# Altium schematic sheet espDownloadBoard.SchDoc
size A4; SheetNumber: 1; SheetTotal: 1
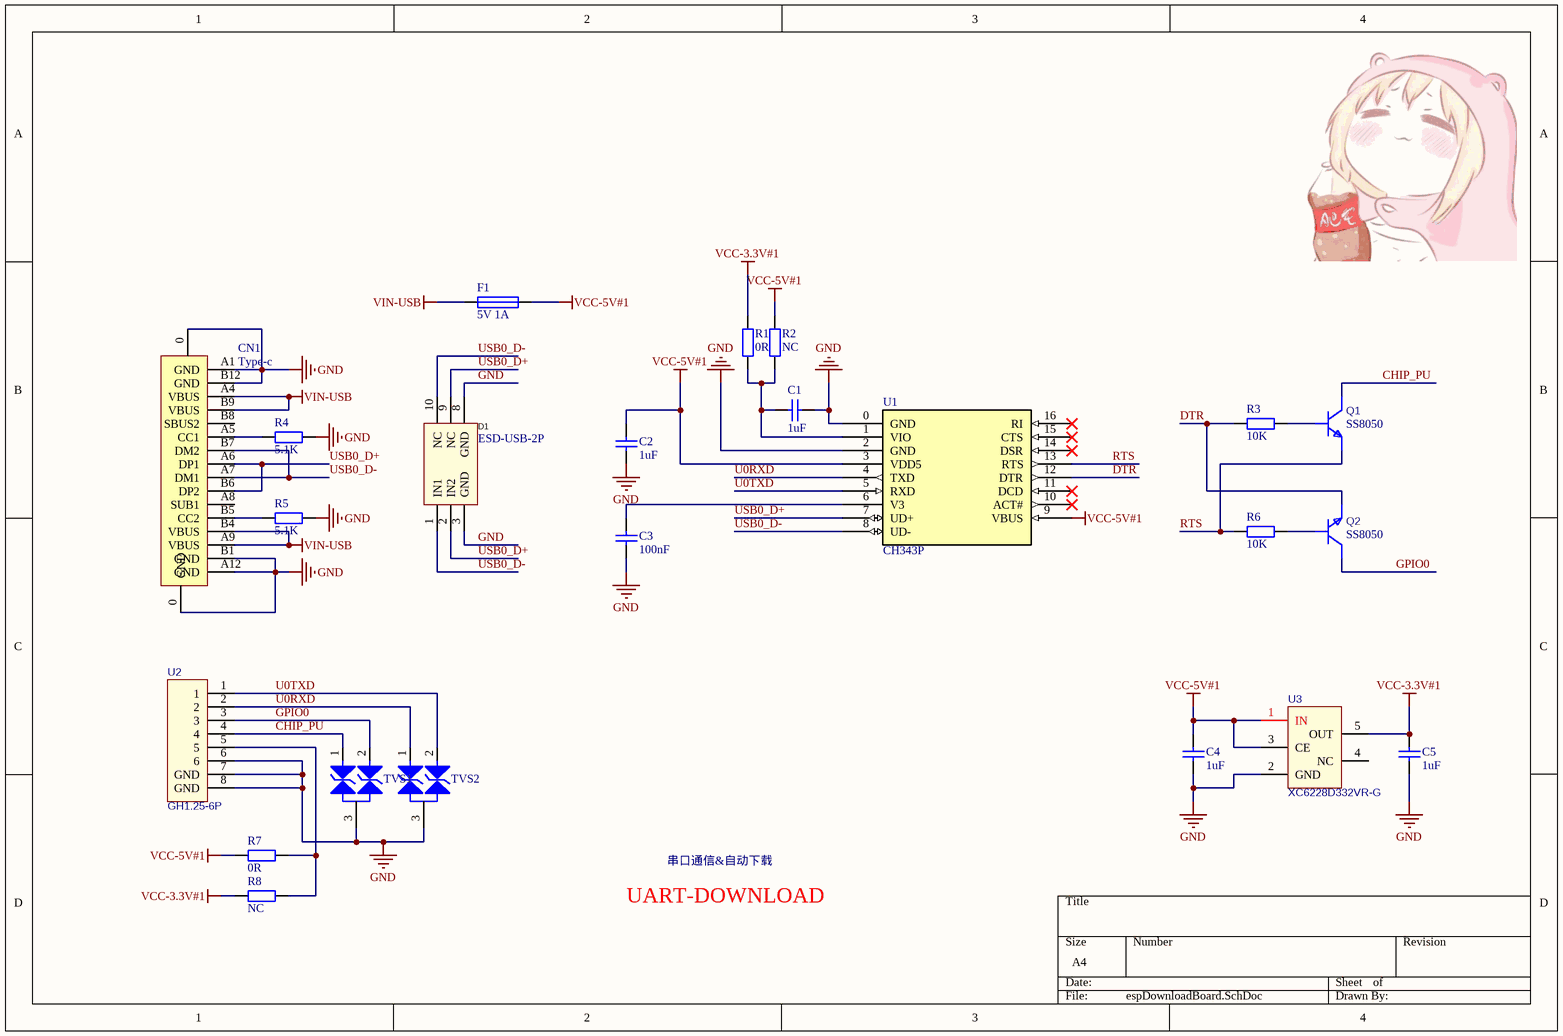
[diagram p0: espDownloadBoard.SchDoc]

## Parts
C1  1uF  [0603-C]
C2  1uF  [0603-C]
C3  100nF  [0603-C]
C4  1uF  [0603-C]
C5  1uF  [0603-C]
CN1  Type-c  [Type-c 16pin]
D1  ESD-USB-2P  [SLP2510P8-2P]
F1  5V 1A  [0805-R]
Q1  SS8050  [SOT23-3M]
Q2  SS8050  [SOT23-3M]
R1  0R  [0603-R]
R2  NC  [0603-R]
R3  10K  [0603-R]
R4  5.1K  [0603-R]
R5  5.1K  [0603-R]
R6  10K  [0603-R]
R7  0R  [0603-R]
R8  NC  [0603-R]
TVS1  ESDA5V3L  [ESDA5V3L]  (value not drawn)
TVS2  ESDA5V3L  [ESDA5V3L]  (value not drawn)
U1  CH343P  [QFN16_3X3]
U2  GH1.25-6P  [CONN-SMD_A1257WR-S-6P]
U3  XC6228D332VR-G  [XC6228D332VR-G]

## Nets
GND: C1.2 C2.2 C3.2 C4.1 C5.1 CN1.0(GND) CN1.A1(GND) CN1.A12(GND) CN1.B1(GND) CN1.B12(GND) D1.3(GND) D1.8(GND) R4.2 R5.2 TVS1.3(K) TVS2.3(K) U1.0(GND) U1.2(GND) U2.6 U2.7(GND) U2.8(GND) U3.2(GND)
VCC-3.3V#1: C5.2 R1.2 R8.2 U3.5(OUT)
VCC-5V#1: C2.1 C4.2 F1.1 R2.2 R7.2 U1.3(VDD5) U1.9(VBUS) U3.1(IN) U3.3(CE)
VIN-USB: CN1.A4(VBUS) CN1.A9(VBUS) CN1.B4(VBUS) CN1.B9(VBUS) F1.2
CHIP_PU: Q1.3(C) TVS1.1(K) U2.4
DTR: Q2.2(E) R3.1 U1.12(DTR)
GPIO0: Q2.3(C) TVS1.2(A) U2.3
RTS: Q1.2(E) R6.1 U1.13(RTS)
U0RXD: TVS2.1(K) U1.4(TXD) U2.2
U0TXD: TVS2.2(A) U1.5(RXD) U2.1
USB0_D+: CN1.A6(DP1) CN1.B6(DP2) D1.2(IN2) D1.9(NC) U1.7(UD+)
USB0_D-: CN1.A7(DM1) CN1.B7(DM2) D1.1(IN1) D1.10(NC) U1.8(UD-)
NetC1_1: C1.1 R1.1 R2.1 U1.1(VIO)
NetC3_1: C3.1 U1.6(V3)
NetCN1_A5: CN1.A5(CC1) R4.1
NetCN1_B5: CN1.B5(CC2) R5.1
NetQ1_1: Q1.1(B) R3.2
NetQ2_1: Q2.1(B) R6.2
NetR7_1: R7.1 R8.1 U2.5

Not connected (* = marked no-connect by the designer): CN1 A8(SUB1) B8(SBUS2); U1 10(ACT#)* 11(DCD)* 14(DSR)* 15(CTS)* 16(RI)*; U3 4(NC)

## Notes on the sheet
- UART-DOWNLOAD
- 串口通信&自动下载

## Library data of the parts
C1-C5 = C: 贴片电容; BOM名称: 无极性贴片电容; 联系卖家，免费查找封装: 唯一出售店铺网址https://shop463601444.taobao.com
CN1 = Type-c: U262-161N-4BVC11
D1 = ESD-USB-2P: RClamp0522PATCT; Manufacturer: SEMTECH; Name: RClamp0524PATCT; Device: RClamp0524PATCT_C40960; Add into BOM: yes; Reverse Stand-Off Voltage (Vrwm): 5V; Breakdown Voltage (VBR): 6V; Clamping Voltage@Ipp: 15V; Peak Pulse Power(Ppp)@8/20us: 150W; Junction Capacitance(Cj)@1MHz: 0.8pF@1MHz; Symbol: RClamp0524PATCT; LCSC Part Name: RClamp0524PATCT; Supplier Part: C40960; Manufacturer Part: RClamp0524PATCT; Supplier Footprint: SLP2510P8; JLCPCB Part Class: Extended Part; Datasheet: https://atta.szlcsc.com/upload/public/pdf/source/20150124/1457707260739.pdf; Supplier: LCSC; Convert to PCB: yes; Operating Temperature: -55℃~+125℃@(Tj)
F1 = FUSE: 自恢复保险丝
R1-R8 = R: 贴片电阻; 联系卖家，免费查找封装: 唯一出售店铺网址https://shop463601444.taobao.com; BOM名称: 贴片电阻
U1 = CH343P: USB to high speed enhanced TTL Serial / UART
U2 = GH1.25-6P: GH1.25-4PWBPZ; BOM_Manufacturer: BOOMELE(博穆精密); Contributor: LCSC; BOM_Supplier: LCSC; BOM_Supplier Part: C2829253; BOM_Manufacturer Part: GH1.25-4PWBPZ; spicePre: U; spiceSymbolName: GH1.25-4PWBPZ
U3 = XC6228D332VR-G: 输出类型：固定 输出极性：正 输出通道数：1 最大输入电压：5.5V 输出电压：3.3V 压差：305mV@(300mA) 输出电流：300mA 电源纹波抑制比(PSRR)：80dB@(1kHz) 3.3V固定输出，Iout=300mA，Vin=5.5V(Max); BOM_Manufacturer: TOREX; BOM_Supplier: LCSC; BOM_Manufacturer Part: XC6228D332VR-G; BOM_Supplier Part: C69841; BOM_JLCPCB Part Class: Extended Part; spicePre: U; spiceSymbolName: XC6228D332VR-G